# EAGLE design 6pin break out (EAGLE 6.5.0)
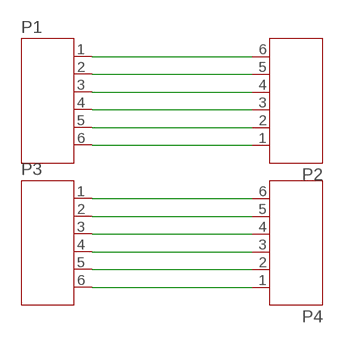
[diagram p0: schematic, sheet 1]

## Parts
P1  JST-PH6  [JST-PH6]
P2  JST-PH6  [JST-PH6]
P3  JST-PH6  [JST-PH6]
P4  JST-PH6  [JST-PH6]

## Nets
N$1: P1.1 P2.6
N$2: P1.2 P2.5
N$3: P1.3 P2.4
N$4: P1.4 P2.3
N$5: P1.5 P2.2
N$6: P1.6 P2.1
N$7: P3.1 P4.6
N$8: P3.2 P4.5
N$9: P3.3 P4.4
N$10: P3.4 P4.3
N$11: P3.5 P4.2
N$12: P3.6 P4.1

## Library data of the parts
P1-P4 = jst-ph:JST-PH6

## Net classes
0 default: width 0.762 mm, drill 0.635 mm, clearance 0.381 mm

## Board
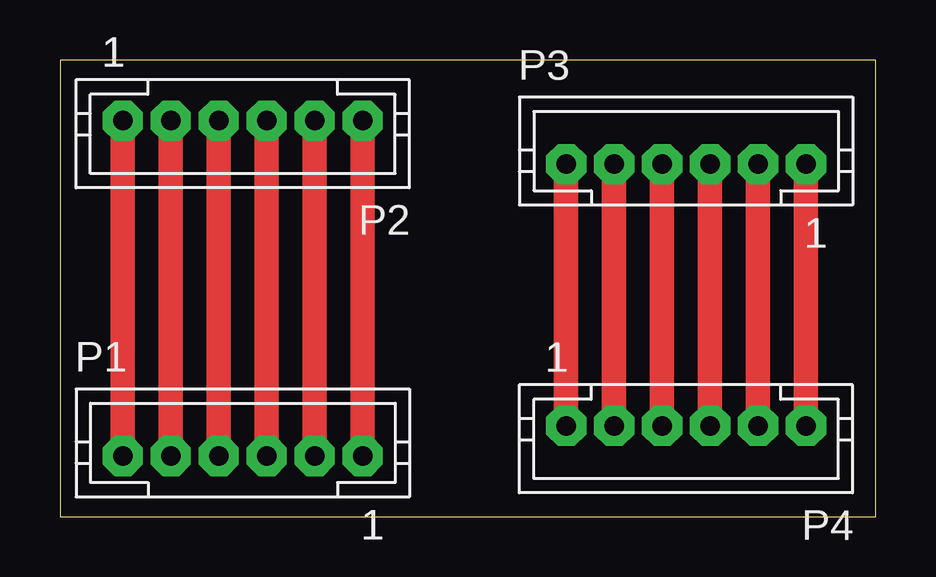
[diagram p1: board, top side]

Size 34.01 x 19.04 mm. Coordinates in mm from the lower left corner, seen from the top.
Outline: 0,0 34.01,0 34.01,19.04 0,19.04 0,0
Copper layers (1*16): Top 0.035mm / dielectric 1.5mm / Bottom 0.035mm
Design rules "default": minimum track width 10mil, minimum drill 24mil, track to track 8mil, track to pad 8mil, pad to pad 8mil, via to via 8mil, smd to smd 8mil, copper to edge 40mil, drill to drill 8mil, minimum pad ring 10mil, minimum via ring 8mil, stop-mask expansion 4mil, vias tented up to drill 0mil, thermal gap 10mil

### Footprints (pad centres in the part's own frame; a part is rotated, then mirrored left to right if it is on the bottom)
JST-PH6 = drill 0.813 pad 1.676 octagon: 1 5,0; 2 3,0; 3 1,0; 4 -1,0; 5 -3,0; 6 -5,0

### Placement (x,y rotation side)
P1  7.62,2.54 0 top
P2  7.62,16.51 180 top
P3  26.1,14.7 0 top
P4  26.1,3.8 180 top

### Tracks (layer width: path | path; a pad name or v marks a point on that pad's centre or on a via)
N$1
  Top 0.762: 12.7,2.54 P1.1
  Top 1.016: 12.7,16.51 P2.6 P1.1
N$2
  Top 1.016: P2.5 P1.2
N$3
  Top 0.762: 8.89,2.54 P1.3
  Top 1.016: 8.89,16.51 P2.4 P1.3
N$4
  Top 0.762: 6.35,2.54 P1.4
  Top 1.016: 6.35,16.51 P2.3 P1.4
N$5
  Top 1.016: P2.2 P1.5
N$6
  Top 0.762: 2.54,2.54 P1.6
  Top 1.016: 2.54,16.51 P2.1 P1.6
N$7
  Top 1.016: P3.1 P4.6
N$8
  Top 1.016: P3.2 P4.5
N$9
  Top 1.016: P3.3 P4.4
N$10
  Top 1.016: P3.4 P4.3
N$11
  Top 1.016: P3.5 P4.2
N$12
  Top 1.016: P3.6 P4.1